# EAGLE design Schematic (EAGLE 9.6.2)
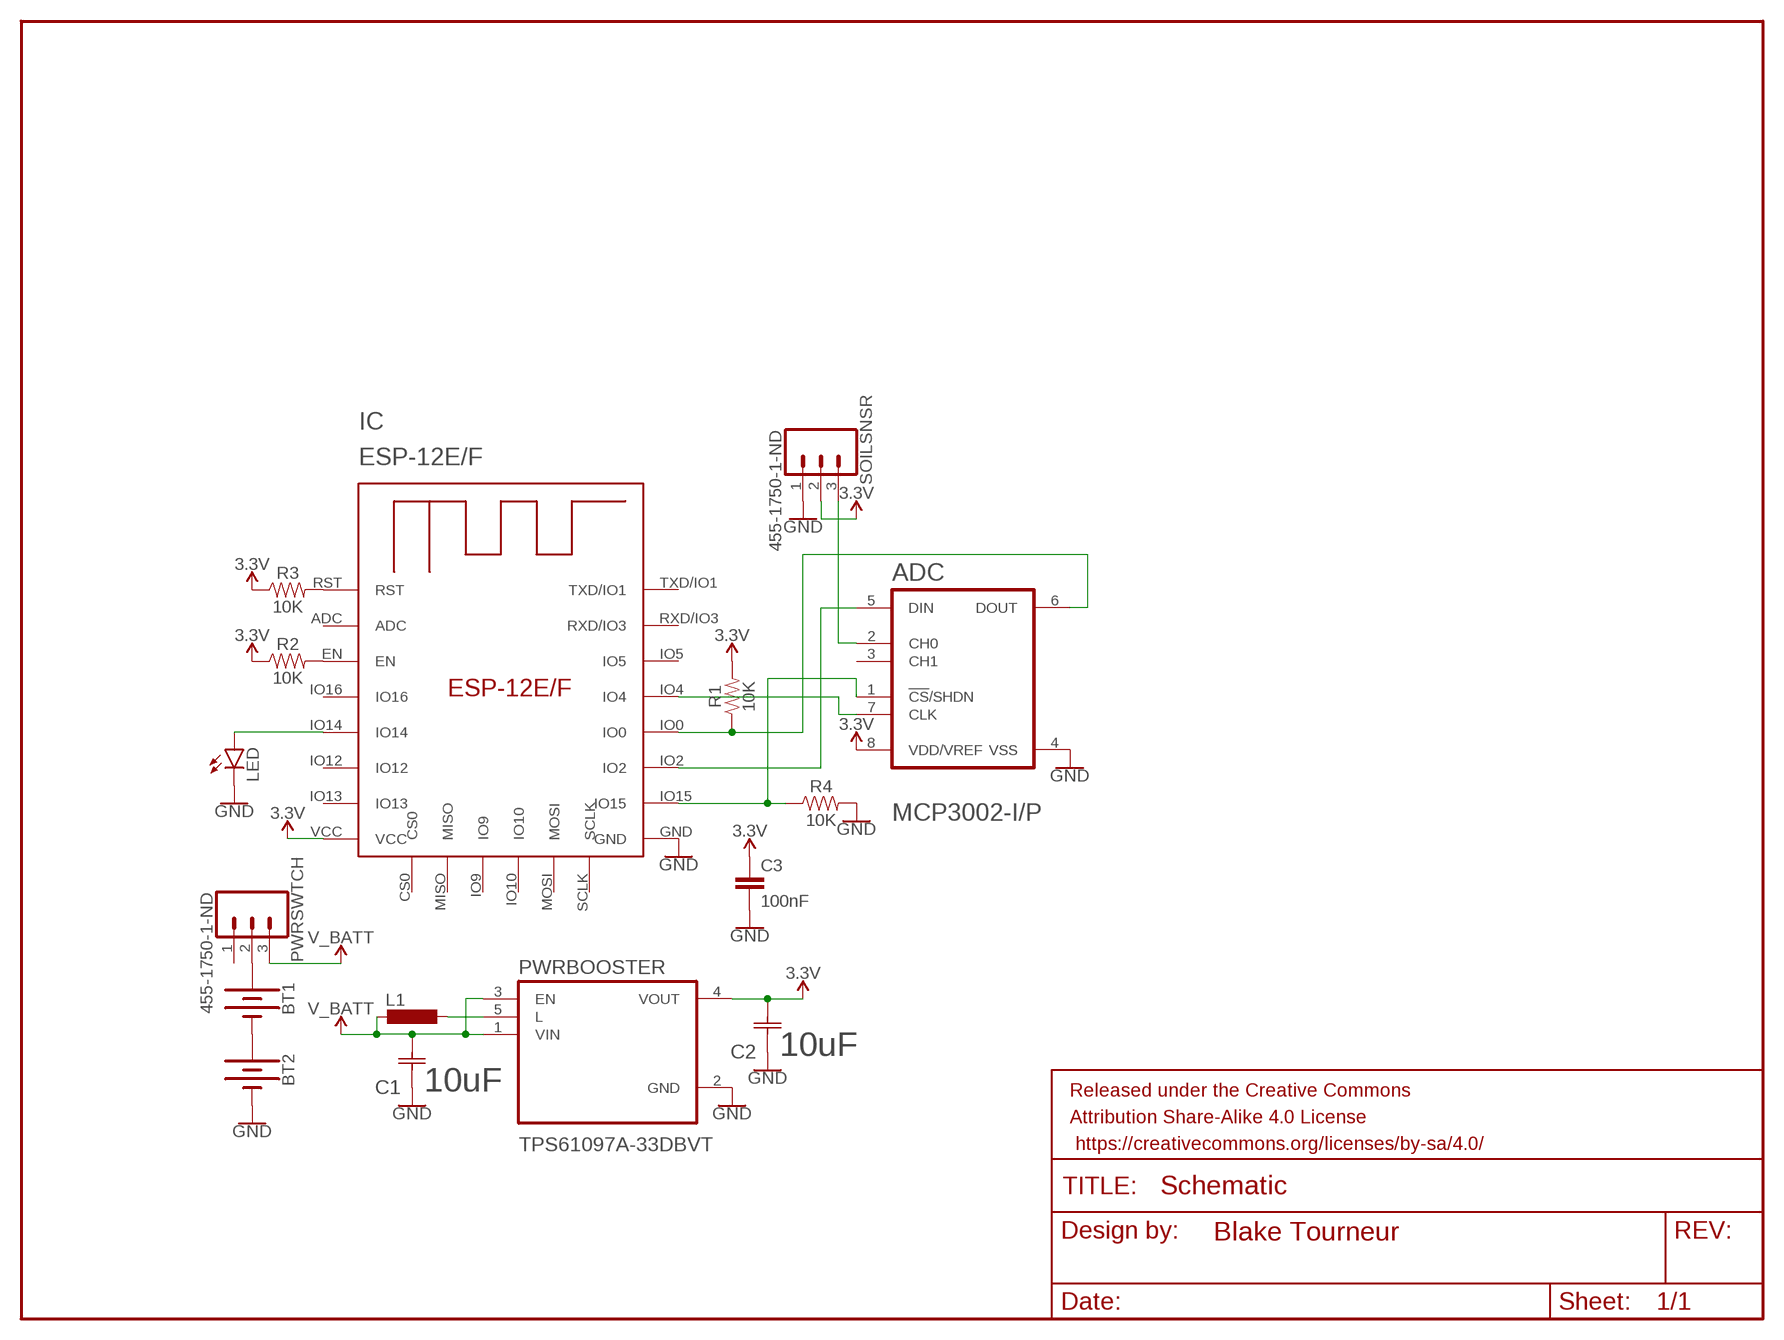
[diagram p0: schematic, sheet 1]

## Parts
ADC  MICROCHIP_MCP3002-I-PMICROCHIP_MCP3002-I-P_0_0  [MICROCHIP_MCP3002-I-P_0]
BT1  BATTERY-AA  [BATTERY-AA]
BT2  BATTERY-AA  [BATTERY-AA]
C1  10uF  GRM31CR70J106KA01L  [CAPC3216X180N]
C2  10uF  GRM31CR70J106KA01L  [CAPC3216X180N]
C3  100nF  C2,5-3  [C2.5-3]
FRAME1  FRAME-LETTERNO_PACKAGE  [DUMMY]
IC  ESP-12E/F  [ESP-12E]
L1  DO3316P  [DO3316P]
LED  LED3MM  [LED3MM]
PWRBOOSTER  TPS61097A-33DBVT  [SOT95P280X145-5N]
PWRSWTCH  455-1750-1-ND  CONN_03  [1X03]
R1  10K  10KOHM-0402-1/10W-0.1%  [0402-TIGHT]
R2  10K  10KOHM-0402-1/10W-0.1%  [0402-TIGHT]
R3  10K  10KOHM-0402-1/10W-0.1%  [0402-TIGHT]
R4  10K  10KOHM-0402-1/10W-0.1%  [0402-TIGHT]
SOILSNSR  455-1750-1-ND  CONN_03  [1X03]

## Nets
3.3V: ADC.8(VDD/VREF) C2.2(C2) C3.1 IC.VCC PWRBOOSTER.4(VOUT) R1.2 R2.1 R3.1 SOILSNSR.2
ASENS0: ADC.2(CH0) SOILSNSR.3
COIL: L1.2 PWRBOOSTER.5(L)
CS: ADC.1(!CS!/SHDN) IC.IO15 R4.1
GND: ADC.4(VSS) BT2.GND@1(-) C1.1(C1) C2.1(C1) C3.2 IC.GND LED.K(C) PWRBOOSTER.2(GND) R4.2 SOILSNSR.1
IO0: ADC.6(DOUT) IC.IO0 R1.1
LED: IC.IO14 LED.A
MCPCLK: ADC.7(CLK) IC.IO4
MCPDIN: ADC.5(DIN) IC.IO2
N$1: BT1.GND@1(-) BT2.PWR@1(+)
N$2: BT1.PWR@1(+) PWRSWTCH.2
N$5: IC.EN R2.2
N$6: IC.RST R3.2
V_BATT: C1.2(C2) L1.1 PWRBOOSTER.1(VIN) PWRBOOSTER.3(EN) PWRSWTCH.3
Unconnected: ADC.3(CH1) IC.ADC IC.CS0 IC.IO5 IC.IO9 IC.IO10 IC.IO12 IC.IO13 IC.IO16 IC.MISO IC.MOSI IC.RXD/IO3 IC.SCLK IC.TXD/IO1 PWRSWTCH.1

## Library data of the parts
ADC = MCP3002:MICROCHIP_MCP3002-I-P: CON-ADC-MCP3002-8; CIIVA_IDS: 2293973; CODE__JEDEC: MS-001; COMPONENT_LINK_1_DESCRIPTION: Manufacturer URL; COMPONENT_LINK_1_URL: http://www.microchip.com/; COMPONENT_LINK_3_DESCRIPTION: Package Specification; COMPONENT_LINK_3_URL: http://www.microchip.com/stellent/groups/techpub_sg/documents/packagingspec/en012702.pdf; DATASHEET: http://ww1.microchip.com/downloads/en/DeviceDoc/21294E.pdf; DATASHEET_VERSION: revE, Nov-2011; FOOTPRINT_VARIANT_NAME_0: Manufacturer Recommended; IMPORTED: yes; IMPORTED_FROM: vault; IMPORT_TS: 1521843716; MF: Microchip; MPN: MCP3002-I/P; PACKAGE: PDIP300-P8; PACKAGE_DESCRIPTION: 8-Lead Plastic Dual In-Line (P) - 300 mil Body [PDIP]; PACKAGE_VERSION: revBB, Aug-2009; PIN_0_0_6_INSIDE_EDGE: clock; PREFIX: U; RELEASE_DATE: 1331962296; VAULT_GUID: 4280AEAC-333D-4A10-9336-C9C485D9AFF8; VAULT_REVISION: F0AB36E4-60F8-4ABB-915A-FEDE2A98AA95
BT1 BT2 = SparkFun-Batteries:BATTERY: Battery - Single Cell A variety of battery chemistries, sizes, and footprints. Device List: 20MM_PTH - Coin Cell Battery Holder - 20mm (PTH) <https://www.sparkfun.com/products/783> 20MM_PTH_KIT- Coin Cell battery Holder - 20 mm (PTH) <http://www.sparkfun.com/products/783>kit version with special mask 6.8MM_PTH - Coin Cell Battery Holder - 6.8MM(SMD) <https://www.digikey.com/product-detail/en/seiko-instruments/MS621FE-FL11E/728-1057-ND/1889208?WT.srch=1&gclid=CNOQ5a6LzdQCFZS2wAodXCkE0g> 12MM_SMD - Coin Cell Battery Holder - 12mm (SMD) <https://www.sparkfun.com/products/10592> 12MM_PTH - Coin Cell Battery Holder - 12mm (PTH) <https://www.sparkfun.com/products/7948> 20MM_SMD - 20mm Coin Cell Battery Holder (SMD) (2 legs) Used on the Big Time Watch Kit <https://www.sparkfun.com/products/11734> 20MM_SMD_4LEGS - Coin Cell Battery Holder - 20mm (SMD) <https://www.sparkfun.com/products/11892> 20MM_SMD_4LEGS_OVERPASTE - Coin Cell Battery Holder - 20mm (SMD) <https://www.sparkfun.com/products/11892> (Over-paste on the legs) 24.5MM_PTH - Coin Cell Battery Holder - 24.5mm (PTH) <https://www.sparkfun.com/products/8863> 9V - 9V Battery Holder - PC Mount Used on the SparkFun SparkPunk Sound Kit <https://www.sparkfun.com/products/11177> and SparkFun SparkPunk Sequencer Kit <https://www.sparkfun.com/products/12707> 18650 - Battery Holder - 18650 (PTH) <https://www.sparkfun.com/products/13113> AA - Battery Holder - 1xAA (PTH) <https://www.sparkfun.com/products/7949> AAA - Battery Holder - 1xAAA (PTH) <https://www.sparkfun.com/products/12718> AA_KIT - Battery Holder - 1xAA (PTH) <https://www.sparkfun.com/products/7949> Special kit package - pads only have exposed copper on one side of the board. AAA_KIT - Battery Holder - 1xAAA (PTH) <https://www.sparkfun.com/products/12718> Special kit package - pads only have exposed copper on one side of the board.; PROD_ID: BATT-08316; SF_SKU: PRT-07949
C1 C2 = Murata_By_element14_Batch_1:GRM31CR70J106KA01L: CAPACITOR, 1206; MPN: GRM31CR70J106KA01L; OC_FARNELL: 9527729; OC_NEWARK: 74K4274; SUPPLIER: Murata; TOLERANCE: ±10%; VOLTAGERATING: 6.3V
C3 = capacitor-wima:C: CAPACITOR naming: grid - package width
FRAME1 = SparkFun-Aesthetics:FRAME-LETTER: Schematic Frame - Letter Standard 8.5x11 US Letter frame; DESIGNER: Blake Tourneur; VERSION: v02
IC = esp-12e-f:ESP-12E/F
L1 = inductor-coilcraft:DO3316P: COILCRAFT; OC_FARNELL: unknown; OC_NEWARK: unknown
LED = led:LED: LED OSRAM: - CHIPLED LG R971, LG N971, LY N971, LG Q971, LY Q971, LO R971, LY R971 LH N974, LH R974 LS Q976, LO Q976, LY Q976 LO Q996 - Hyper CHIPLED LW Q18S LB Q993, LB Q99A, LB R99A - SideLED LS A670, LO A670, LY A670, LG A670, LP A670 LB A673, LV A673, LT A673, LW A673 LH A674 LY A675 LS A676, LA A676, LO A676, LY A676, LW A676 LS A679, LY A679, LG A679 - Hyper Micro SIDELED® LS Y876, LA Y876, LO Y876, LY Y876 LT Y87S - SmartLED LW L88C, LW L88S LB L89C, LB L89S, LG L890 LS L89K, LO L89K, LY L89K LS L896, LA L896, LO L896, LY L896 - TOPLED LS T670, LO T670, LY T670, LG T670, LP T670 LSG T670, LSP T670, LSY T670, LOP T670, LYG T670 LG T671, LOG T671, LSG T671 LB T673, LV T673, LT T673, LW T673 LH T674 LS T676, LA T676, LO T676, LY T676, LB T676, LH T676, LSB T676, LW T676 LB T67C, LV T67C, LT T67C, LS T67K, LO T67K, LY T67K, LW E67C LS E67B, LA E67B, LO E67B, LY E67B, LB E67C, LV E67C, LT E67C LW T67C LS T679, LY T679, LG T679 LS T770, LO T770, LY T770, LG T770, LP T770 LB T773, LV T773, LT T773, LW T773 LH T774 LS E675, LA E675, LY E675, LS T675 LS T776, LA T776, LO T776, LY T776, LB T776 LHGB T686 LT T68C, LB T68C - Hyper Mini TOPLED® LB M676 - Mini TOPLED Santana® LG M470 LS M47K, LO M47K, LY M47K Source: http://www.osram.convergy.de LUXEON: - LUMILED® LXK2-PW12-R00, LXK2-PW12-S00, LXK2-PW14-U00, LXK2-PW14-V00 LXK2-PM12-R00, LXK2-PM12-S00, LXK2-PM14-U00 LXK2-PE12-Q00, LXK2-PE12-R00, LXK2-PE12-S00, LXK2-PE14-T00, LXK2-PE14-U00 LXK2-PB12-K00, LXK2-PB12-L00, LXK2-PB12-M00, LXK2-PB14-N00, LXK2-PB14-P00, LXK2-PB14-Q00 LXK2-PR12-L00, LXK2-PR12-M00, LXK2-PR14-Q00, LXK2-PR14-R00 LXK2-PD12-Q00, LXK2-PD12-R00, LXK2-PD12-S00 LXK2-PH12-R00, LXK2-PH12-S00 LXK2-PL12-P00, LXK2-PL12-Q00, LXK2-PL12-R00 Source: www.luxeon.com KINGBRIGHT: KA-3528ASYC Source: www.kingbright.com
PWRBOOSTER = TPS61097A-33DBVT:TPS61097A-33DBVT: Check prices <https://pricing.snapeda.com/parts/TPS61097A-33DBVT/Texas%20Instruments/view-part?ref=eda>; AVAILABILITY: In Stock; DESCRIPTION: 0.9Vin, 3.3Vout Boost Converter with Bypass Switch - 5nA Shutdown Current 5-SOT-23 -40 to 85; MF: Texas Instruments; MP: TPS61097A-33DBVT; PACKAGE: SOT-23-5 Texas Instruments; PRICE: None; PURCHASE-URL: https://pricing.snapeda.com/search/part/TPS61097A-33DBVT/?ref=eda
PWRSWTCH SOILSNSR = SparkFun-Connectors:CONN_03: Multi connection point. Often used as Generic Header-pin footprint for 0.1 inch spaced/style header connections On any of the 0.1 inch spaced packages, you can populate with these: Break Away Headers - Straight <https://www.sparkfun.com/products/116> (PRT-00116) Break Away Male Headers - Right Angle <https://www.sparkfun.com/products/553> (PRT-00553) Female Headers <https://www.sparkfun.com/products/115> (PRT-00115) Break Away Headers - Machine Pin <https://www.sparkfun.com/products/117> (PRT-00117) Break Away Female Headers - Swiss Machine Pin <https://www.sparkfun.com/products/743> (PRT-00743) Stackable Header - 3 Pin (Female, 0.1") <https://www.sparkfun.com/products/13875> (PRT-13875) For SCREWTERMINALS and SPRING TERMINALS visit here: Screw Terimnals on SparkFun.com <https://www.sparkfun.com/search/results?term=Screw+Terminals> (5mm/3.5mm/2.54mm spacing) This device is also useful as a general connection point to wire up your design to another part of your project. Our various solder wires solder well into these plated through hole pads. Hook-Up Wire - Assortment (Stranded, 22 AWG) <https://www.sparkfun.com/products/11375> (PRT-11375) Hook-Up Wire - Assortment (Solid Core, 22 AWG) <https://www.sparkfun.com/products/11367> (PRT-11367) View the entire wire category on our website here <https://www.sparkfun.com/categories/141> Special notes: Molex polarized connector foot print use with SKU : PRT-08232 with associated crimp pins and housings.; PROD_ID: XXX-00000
R1-R4 = SparkFun-Resistors:10KOHM: 10kΩ resistor A resistor is a passive two-terminal electrical component that implements electrical resistance as a circuit element. Resistors act to reduce current flow, and, at the same time, act to lower voltage levels within circuits. - Wikipedia; PROD_ID: RES-16147

## Board
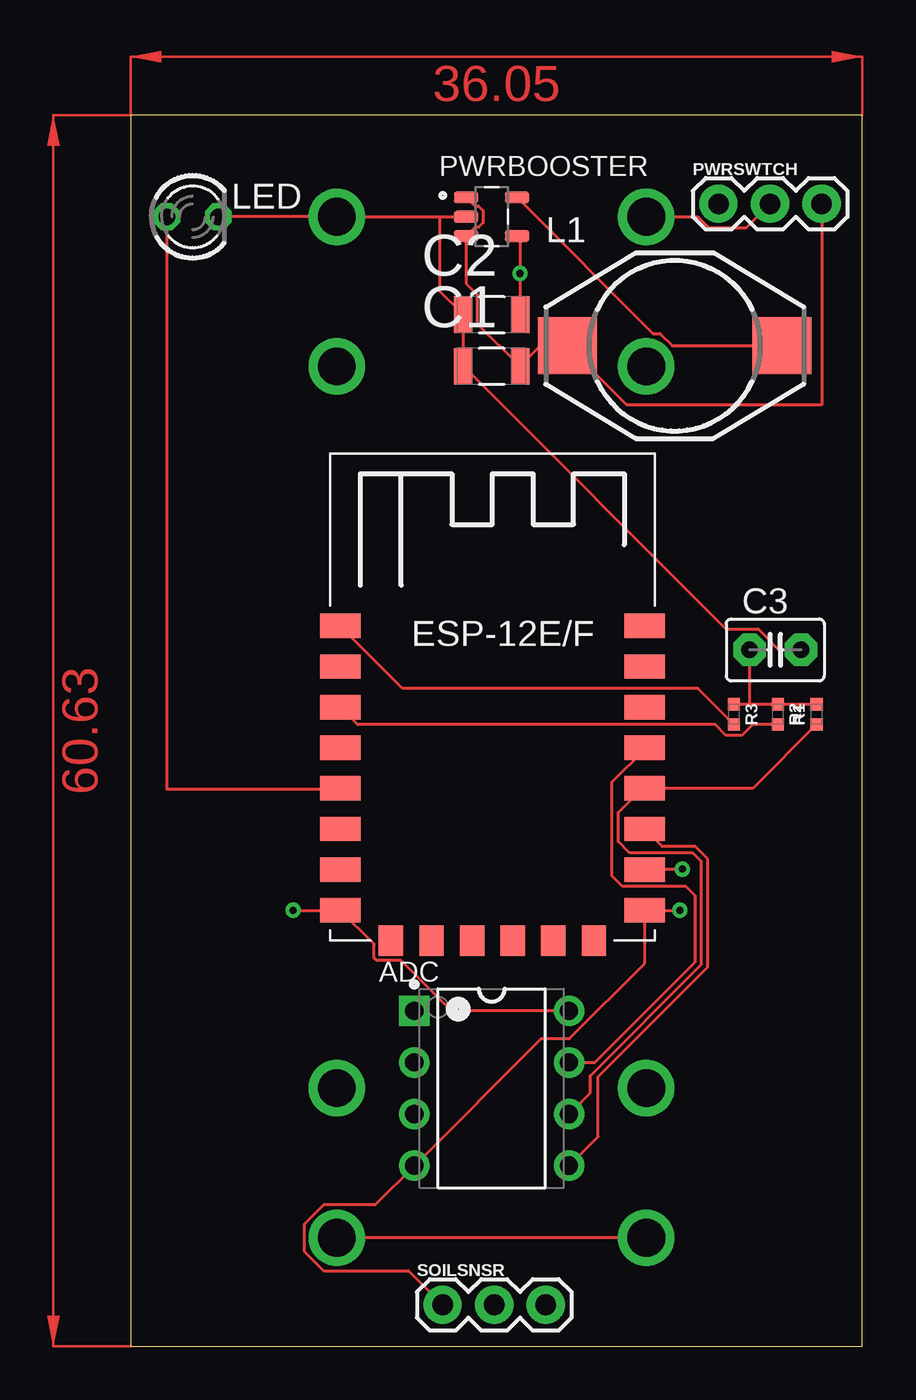
[diagram p1: board, top side]
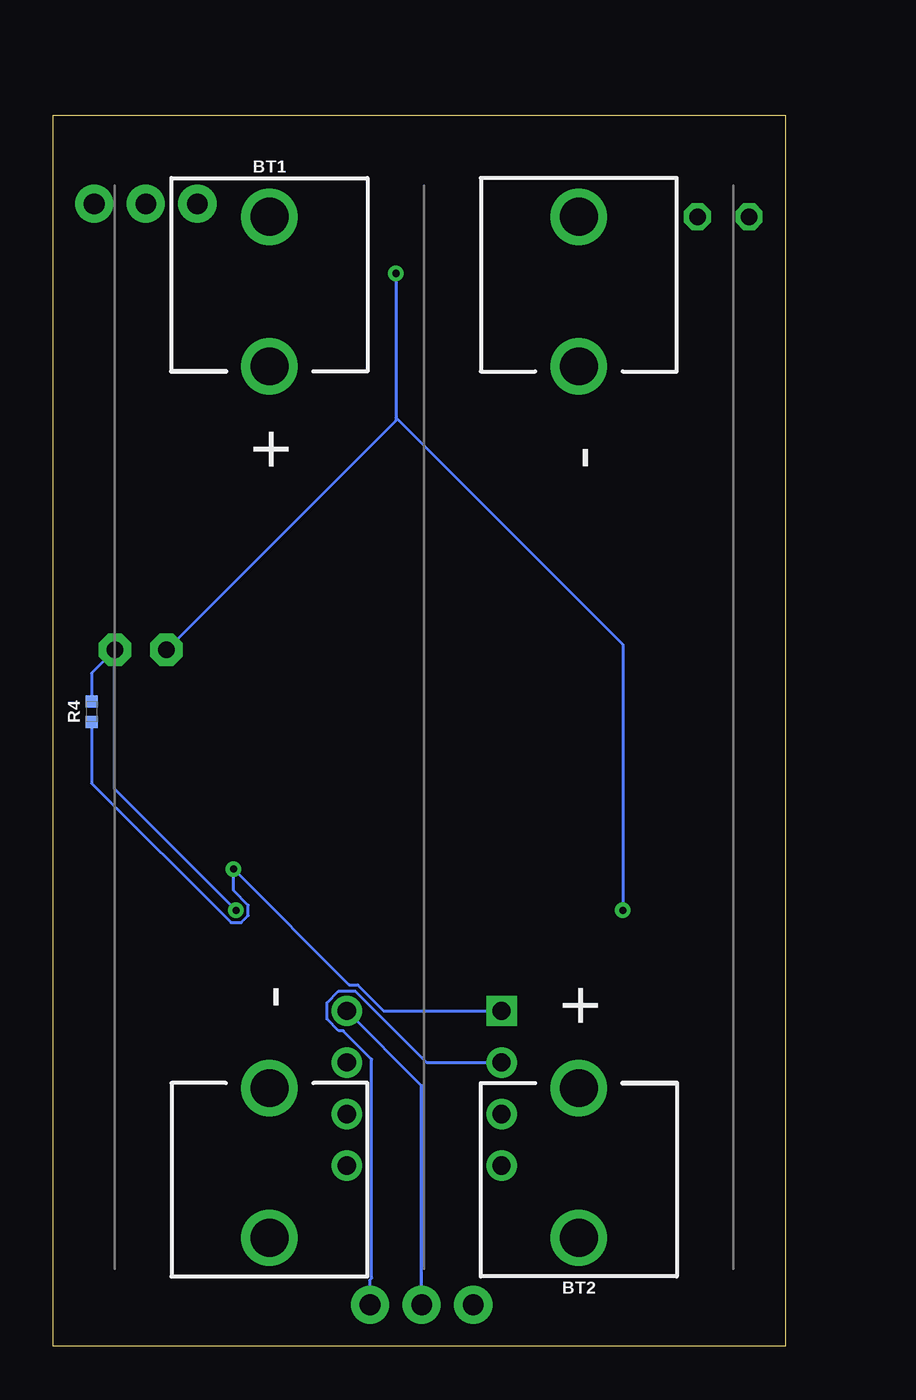
[diagram p2: board, bottom side, seen from below]

Size 36.05 x 60.63 mm. Coordinates in mm from the lower left corner, seen from the top.
Outline: 0,0 36.05,0 36.05,60.63 0,60.63 0,0
Copper layers (1*16): Top 0.035mm / dielectric 1.5mm / Bottom 0.035mm
Design rules "default": minimum track width 6mil, minimum drill 0.35mm, track to track 6mil, track to pad 6mil, pad to pad 6mil, via to via 6mil, smd to smd 6mil, copper to edge 40mil, drill to drill 6mil, minimum pad ring 10mil, minimum via ring 8mil, stop-mask expansion 4mil, vias tented up to drill 0mil, thermal gap 10mil

### Footprints (pad centres in the part's own frame; a part is rotated, then mirrored left to right if it is on the bottom)
MICROCHIP_MCP3002-I-P_0 = drill 0.9 pad 1.5 square: 1 -3.81,3.81 | drill 0.9 pad 1.5: 2 -3.81,1.27; 3 -3.81,-1.27; 4 -3.81,-3.81; 5 3.81,-3.81; 6 3.81,-1.27; 7 3.81,1.27; 8 3.81,3.81
BATTERY-AA = drill 1.854: GND@1 25.146,0; GND@2 17.78,0; PWR@1 -25.146,0; PWR@2 -17.78,0
CAPC3216X180N = smd 0.914 x 1.803: 1 -1.397,0; 2 1.397,0
C2.5-3 = drill 0.813 pad 1.6 octagon: 1 -1.27,0; 2 1.27,0
ESP-12E = smd 2 x 1.2: ADC -7.46,5.53; EN -7.46,3.53; GND 7.54,-6.47; IO0 7.54,-0.47; IO2 7.54,-2.47; IO4 7.54,1.53; IO5 7.54,3.53; IO12 -7.46,-2.47; IO13 -7.46,-4.47; IO14 -7.46,-0.47; IO15 7.54,-4.47; IO16 -7.46,1.53; RST -7.46,7.53; RXD/IO3 7.54,5.53; TXD/IO1 7.54,7.53; VCC -7.46,-6.47 | smd 1.2 x 1.5: CS0 -4.96,-7.97; IO9 -0.96,-7.97; IO10 1.04,-7.97; MISO -2.96,-7.97; MOSI 3.04,-7.97; SCLK 5.04,-7.97
DO3316P = smd 2.92 x 2.79: 1 -5.28,0; 2 5.28,0
LED3MM = drill 0.813 octagon: A -1.27,0; K 1.27,0
SOT95P280X145-5N = smd 1.21 x 0.59: 1 -1.255,0.95; 2 -1.255,0; 3 -1.255,-0.95; 4 1.255,-0.95; 5 1.255,0.95
1X03 = drill 1.016 pad 1.88: 1 0,0; 2 2.54,0; 3 5.08,0
0402-TIGHT = smd 0.6 x 0.6: 1 -0.5,0; 2 0.5,0

### Placement (x,y rotation side)
ADC  17.78,12.7 0 top
BT1  25.4,30.48 270 bottom
BT2  10.16,30.48 90 bottom
C1  17.78,48.26 0 top
C2  17.78,50.8 0 top
C3  31.75,34.29 0 top
FRAME1  -6.35,-1.27 0 top  (outside the outline)
IC  17.78,27.94 0 top
L1  26.8,49.28 0 top
LED  3.05,55.63 0 top
PWRBOOSTER  17.78,55.63 0 top
PWRSWTCH  28.96,56.26 0 top
R1  33.78,31.11 90 top
R2  31.88,31.11 270 top
R3  29.72,31.11 270 top
R4  34.16,31.24 90 bottom
SOILSNSR  15.37,2.03 0 top

### Tracks (layer width: path | path; a pad name or v marks a point on that pad's centre or on a via)
3.3V  (via drill 0.35)
  Top 0.152: ADC.8 15.79,16.51 13.31,18.99 12.12,18.99 11.99,19.12 11.99,19.8 IC.VCC v8,21.46 | PWRBOOSTER.4 19.18,54.53 v19.18,52.83 C2.2 | C3.1 30.48,31.61 R3.1 R2.1 R1.2
  Bottom 0.152: SOILSNSR.2 17.91,12.83 ADC.8 | v19.18,52.83 19.18,45.72 | 19.18,45.72 19.18,45.59 C3.1 | 19.18,45.72 8,34.54 v8,21.46
ASENS0
  Bottom 0.152: SOILSNSR.3 20.45,3.27 20.37,3.35 20.37,14.13 21.77,15.53 22,15.53 22.57,16.11 22.57,16.91 22,17.49 21.18,17.49 17.67,13.97 ADC.2
COIL
  Top 0.152: PWRBOOSTER.5 25.73,49.88 26.07,49.88 26.67,49.28 L1.2
CS  (via drill 0.35)
  Top 0.152: IC.IO15 25.34,23.5 v27.18,23.5
  Bottom 0.152: ADC.1 19.77,16.51 21.06,17.79 21.48,17.79 v27.18,23.5 27.18,22.45 26.44,21.71 26.44,21.21 26.8,20.86 27.3,20.86 34.16,27.72 R4.1
GND  (via drill 0.35)
  Top 0.152: 15.24,55.63 BT2.GND@1 LED.K | 15.24,55.63 PWRBOOSTER.2 | 15.24,55.63 15.24,51.94 C2.1 C1.1 29.32,35.32 30.91,35.32 31.93,34.29 C3.2 | v27.05,21.46 v27.04,21.47 IC.GND 25.32,18.86 21.61,15.15 20.23,15.15 ADC.4 12.03,6.95 9.49,6.95 8.54,6 8.54,4.66 9.49,3.71 13.68,3.71 SOILSNSR.1
  Bottom 0.152: v27.05,21.46 33.02,27.43 C3.2 34.16,33.15 R4.2
IO0
  Top 0.152: ADC.6 22.64,12.48 22.64,13.32 28.12,18.8 28.12,23.86 27.68,24.3 24.57,24.3 24.02,24.85 24.02,26.29 25.2,27.47 IC.IO0 30.64,27.47 R1.1
LED
  Top 0.152: LED.A 1.78,27.43 10.28,27.43 IC.IO14
MCPCLK
  Top 0.152: IC.IO4 25.32,29.39 23.71,27.78 23.71,23.16 24.23,22.64 27.34,22.64 27.82,22.16 27.82,18.93 22.86,13.97 ADC.7
MCPDIN
  Top 0.152: ADC.5 23.02,10.32 23.02,13.27 28.43,18.68 28.43,23.99 27.81,24.6 26.19,24.6 IC.IO2
N$1
  Top 0.152: BT1.GND@1 BT2.PWR@1
N$2
  Top 0.152: BT1.PWR@1 27.94,55.63 28.47,55.09 30.33,55.09 PWRSWTCH.2
N$5
  Top 0.152: IC.EN 11.18,30.61 28.8,30.61 29.32,30.09 30.11,30.09 30.64,30.61 R2.2
N$6
  Top 0.152: IC.RST 13.4,32.39 27.94,32.39 R3.2
V_BATT
  Top 0.152: PWRBOOSTER.1 16.95,56.15 17.14,56.15 17.36,55.93 17.36,55.32 17.14,55.1 16.95,55.1 PWRBOOSTER.3 16.52,52.34 17.07,51.8 17.07,50.37 C1.2 20.19,49.28 L1.1 24.44,46.35 34.04,46.35 PWRSWTCH.3
(copper drawn outside any net)
  shapes: Top area x2